# EAGLE design 8296 Diagnostic UP (EAGLE 9.6.2)
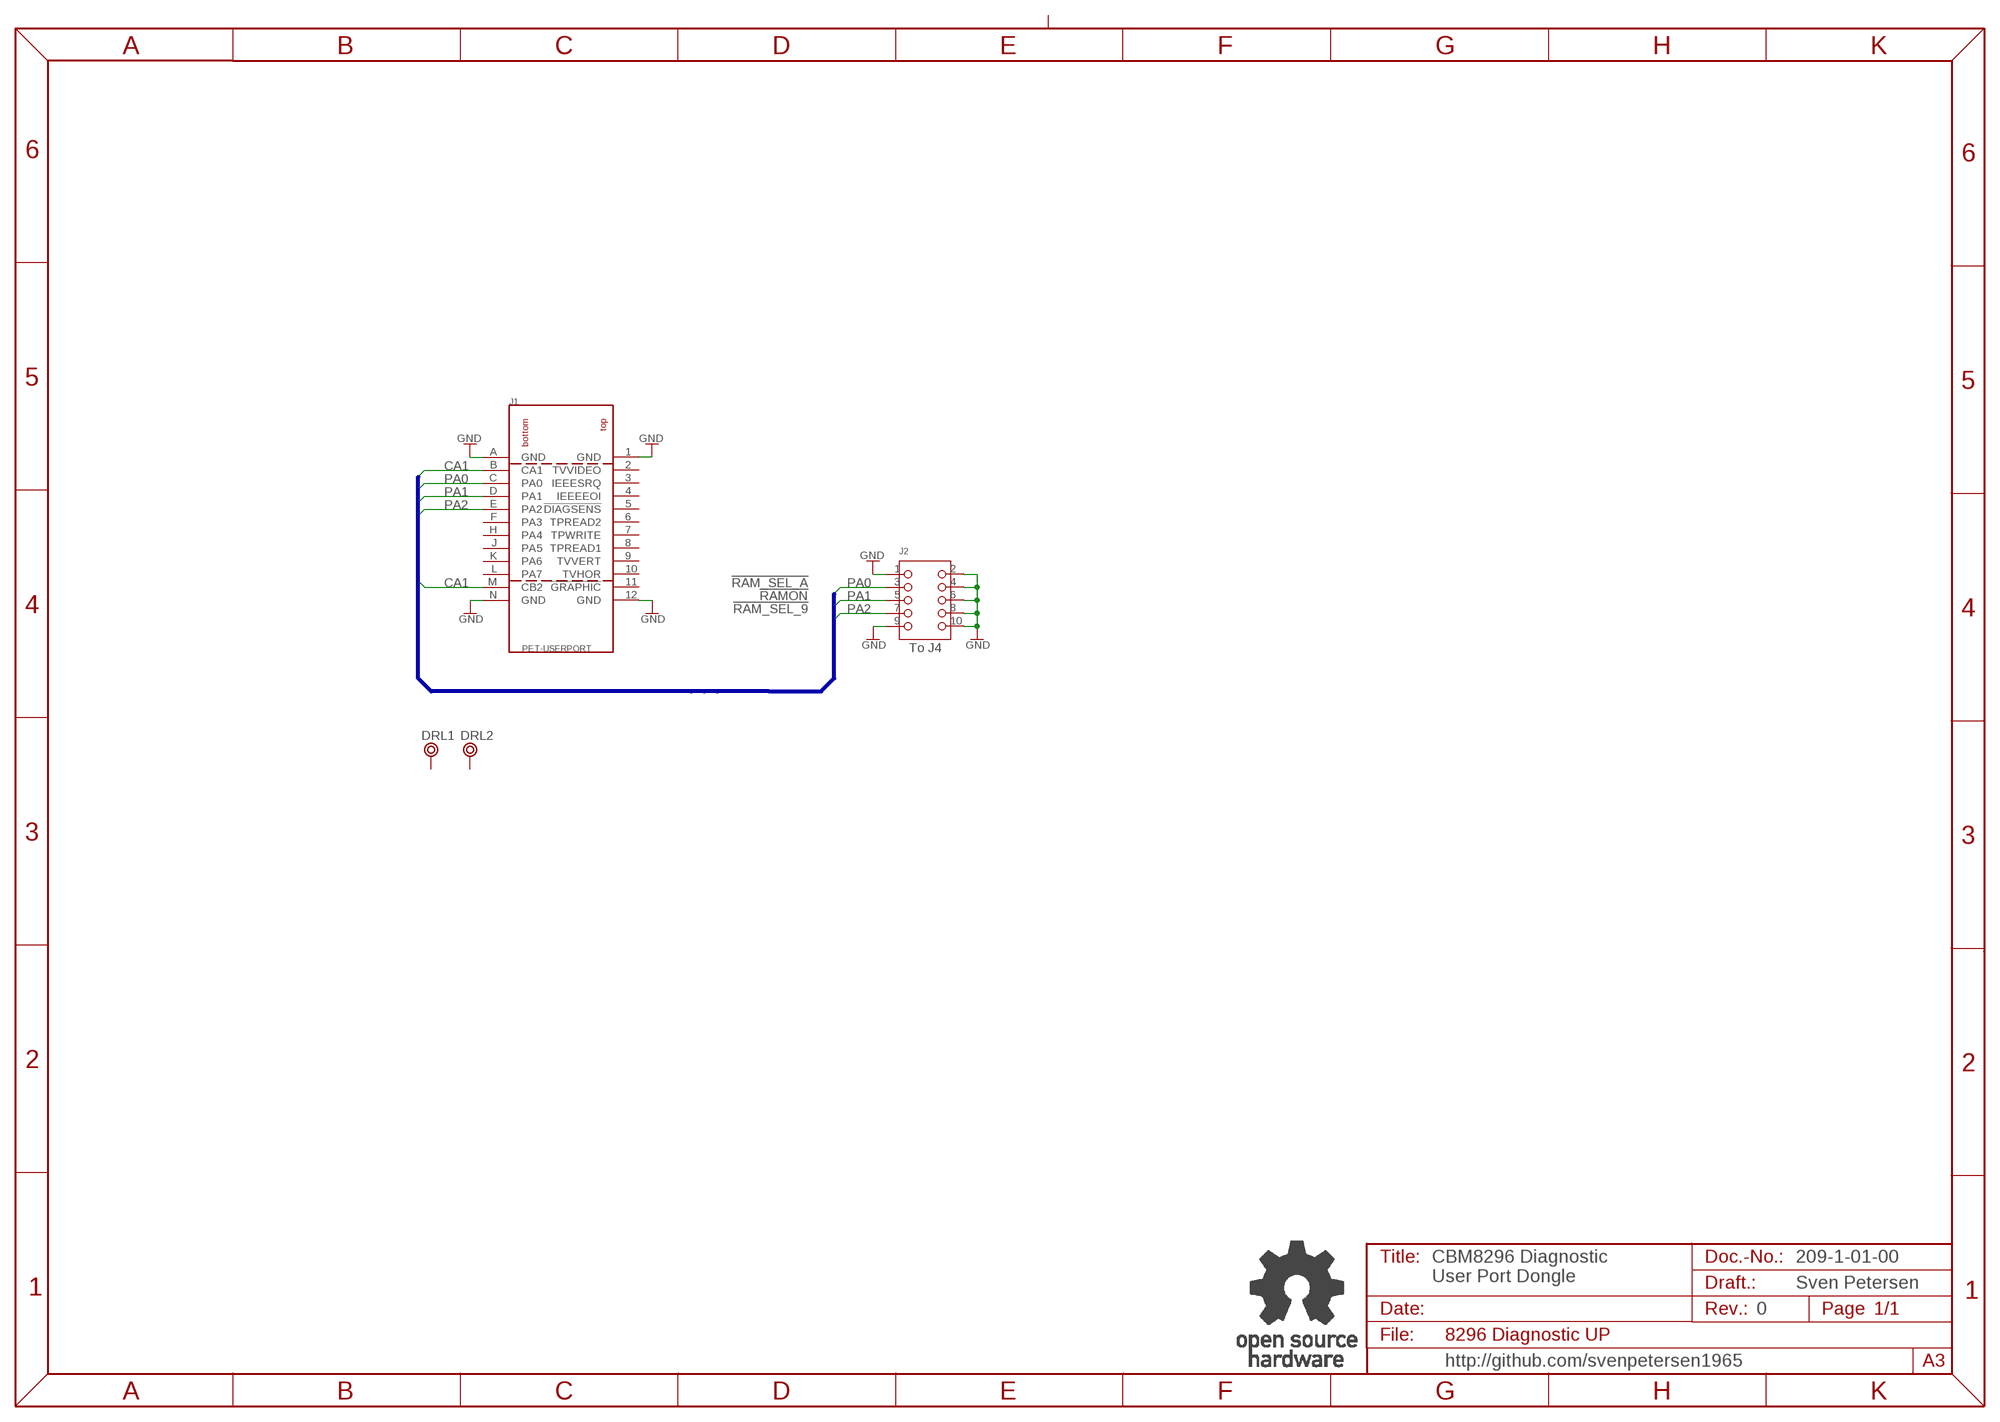
[diagram p0: schematic, sheet 1]

## Parts
DRL1  BOHR3,5  [BOHR3,5]
DRL2  BOHR3,5  [BOHR3,5]
J1  PET-USERPORT  [USERPORT]
J2  2X05WV  [2X05WV]
U$13  OPEN_SOURCE_HW  [OPENHW]

## Nets
CA1: J1.B(CA1) J1.M(CB2)
GND: J1.1(GND) J1.12(GND) J1.A(GND) J1.N(GND) J2.1 J2.2 J2.4 J2.6 J2.8 J2.9 J2.10
PA0: J1.C(PA0) J2.3
PA1: J1.D(PA1) J2.5
PA2: J1.E(PA2) J2.7
Unconnected: DRL1.P$1 DRL2.P$1 J1.2(TVVIDEO) J1.3(IEEESRQ) J1.4(IEEEEOI) J1.5(!DIAGSENS) J1.6(TPREAD2) J1.7(TPWRITE) J1.8(TPREAD1) J1.9(TVVERT) J1.10(TVHOR) J1.11(!GRAPHIC) J1.F(PA3) J1.H(PA4) J1.J(PA5) J1.K(PA6) J1.L(PA7)

## Buses
VIA:CA[1..2],CB[1..2],CS1,!CS2,D[0..7],!IRQ,PA[0..7],PB[0..7],PHI2,!RES,RS[0..3],R/W

## Notes on the sheet
- !RAM_SEL_A
- !RAMON
- !RAM_SEL_9
- To J4
- 209-1-01-00
- CBM8296 Diagnostic
  User Port Dongle
- Sven Petersen
- 0
- http://github.com/svenpetersen1965

## Library data of the parts
DRL1 DRL2 = Mech_Bohr:BOHR3,5
J1 = Commodore:PET-USERPORT
J2 = PINHEAD:2X05WV
U$13 = Logo:OPEN_SOURCE_HW

## Board
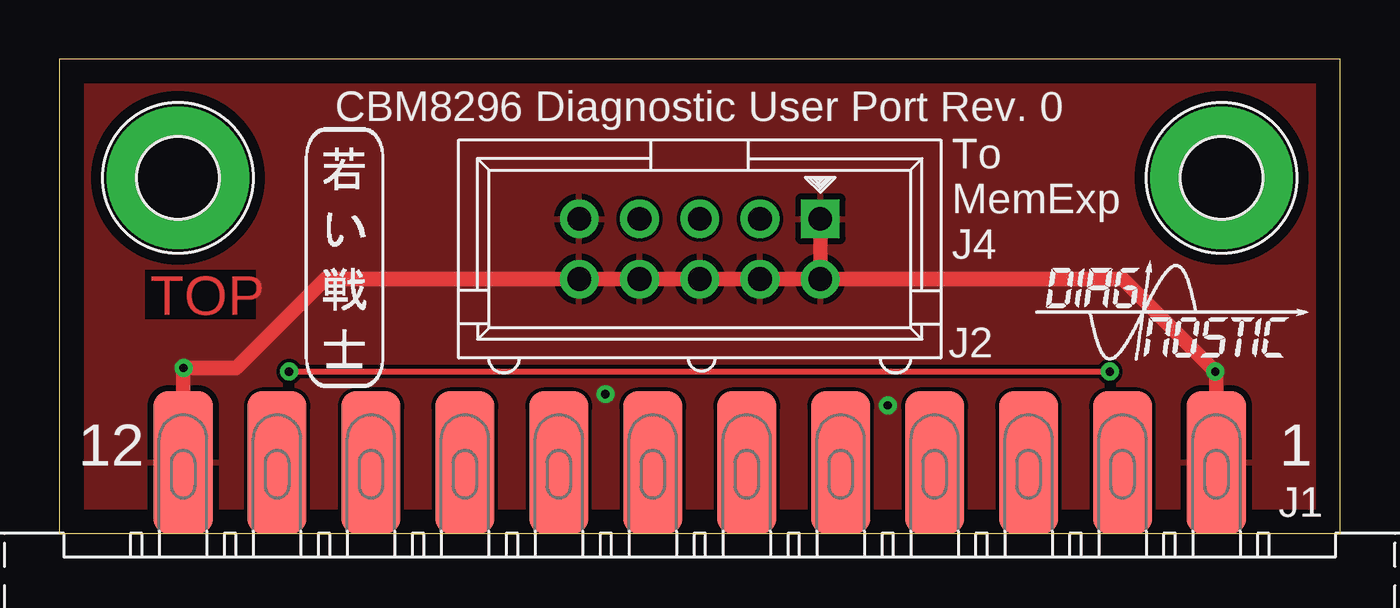
[diagram p1: board, top side]
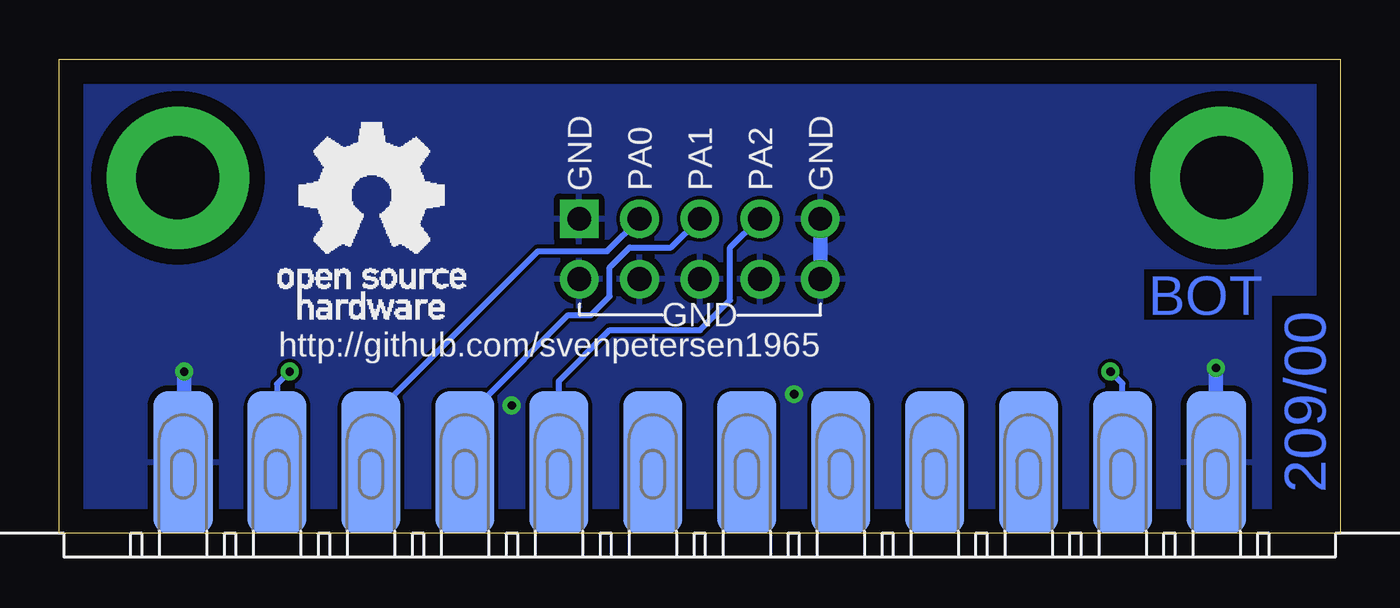
[diagram p2: board, bottom side, seen from below]

Size 54 x 20 mm. Coordinates in mm from the lower left corner, seen from the top.
Outline: 0,0 54,0 54,20 0,20 0,0
Copper layers (1*16): Top 0.035mm / dielectric 1.5mm / Bottom 0.035mm
Design rules "default *": minimum track width 6mil, minimum drill 0.35mm, track to track 6mil, track to pad 6mil, pad to pad 6mil, via to via 6mil, smd to smd 6mil, copper to edge 40mil, drill to drill 6mil, minimum pad ring 10mil, minimum via ring 8mil, stop-mask expansion 4mil, vias tented up to drill 25mil, thermal gap 10mil
bRestrict: 2 lines

### Footprints (pad centres in the part's own frame; a part is rotated, then mirrored left to right if it is on the bottom)
BOHR3,5 = drill 3.5 pad 6: P$1 0,0
USERPORT = smd 2.5 x 6: 1 -21.78,-3; 2 -17.82,-3; 3 -13.86,-3; 4 -9.9,-3; 5 -5.94,-3; 6 -1.98,-3; 7 1.98,-3; 8 5.94,-3; 9 9.9,-3; 10 13.86,-3; 11 17.82,-3; 12 21.78,-3 | smd 2.5 x 6 bottom: A -21.78,-3; B -17.82,-3; C -13.86,-3; D -9.9,-3; E -5.94,-3; F -1.98,-3; H 1.98,-3; J 5.94,-3; K 9.9,-3; L 13.86,-3; M 17.82,-3; N 21.78,-3
2X05WV = drill 1 pad 1.626 square: 1 -5.08,-1.27 | drill 1 pad 1.626: 2 -5.08,1.27; 3 -2.54,-1.27; 4 -2.54,1.27; 5 0,-1.27; 6 0,1.27; 7 2.54,-1.27; 8 2.54,1.27; 9 5.08,-1.27; 10 5.08,1.27

### Placement (x,y rotation side)
DRL1  5,15 0 top
DRL2  49,15 0 top
J1  27,0 180 top
J2  27,12 180 top
U$8  [2LAYER]  3.81,9.21 0 top
U$9  [PCB-TITLE/]  0.16,27.94 0 top  (outside the outline)
U$10  [SVEN_TAG]  12.06,11.75 0 top
U$12  [DIAG_SMALL]  41.12,7.3 0 top
U$13  44.77,9.05 0 bottom

### Tracks (layer width: path | path; a pad name or v marks a point on that pad's centre or on a via)
CA1  (via drill 0.35)
  Top 0.254: v9.68,6.83 v44.29,6.83
  Bottom 0.254: J1.M 9.18,6.32 v9.68,6.83 | v44.29,6.83 44.82,6.3 J1.B
GND  (via drill 0.35)
  Top 0.61: J1.12 5.22,6.97 v5.24,6.99 7.46,6.99 11.21,10.73 J2.10 J2.8 J2.6 J2.4 J2.2 | J1.A 48.78,6.78 | 48.78,6.78 v48.74,6.83 | J2.2 44.83,10.73 48.78,6.78 | J2.2 J2.1
  Bottom 0.61: v5.24,6.99 5.24,3.02 J1.12 | v48.74,6.83 48.74,3.04 J1.A | J2.10 J2.9
  other vias: 23.02,5.87 34.92,5.4
  pour Top: 0.79,19.05 53.02,19.05 53.02,0.79 0.79,0.79
  pour Bottom: 0.79,19.05 53.02,19.05 53.02,0.79 0.79,0.79
PA0
  Bottom 0.152: 40.32,5.4 40.86,4.86 J1.C
  Bottom 0.254: J2.3 30.9,11.91 33.81,11.91 40.32,5.4
PA1
  Bottom 0.254: J1.D 36.2,3.71 36.2,5.56 32.54,9.21 31.59,9.21 30.8,10 30.8,11.22 29.95,12.06 28.2,12.06 J2.5
PA2
  Bottom 0.254: J1.E 32.94,6.43 30.8,8.57 26.99,8.57 25.72,9.84 25.72,12.06 24.51,13.27 J2.7

### Text on the board
Bottom: 209/00
tPlace: CBM8296 Diagnostic User Port Rev. 0 | 12 | 1
tNames: To / MemExp / J4
bNames: GND | PA2 | PA1 | PA0 | GND | GND | http://github.com/svenpetersen1965
Document: 209-2-01-00 | Sven Petersen / 2023 | 35µm | 2 | 0